# EAGLE design candle (EAGLE 6.6.0)
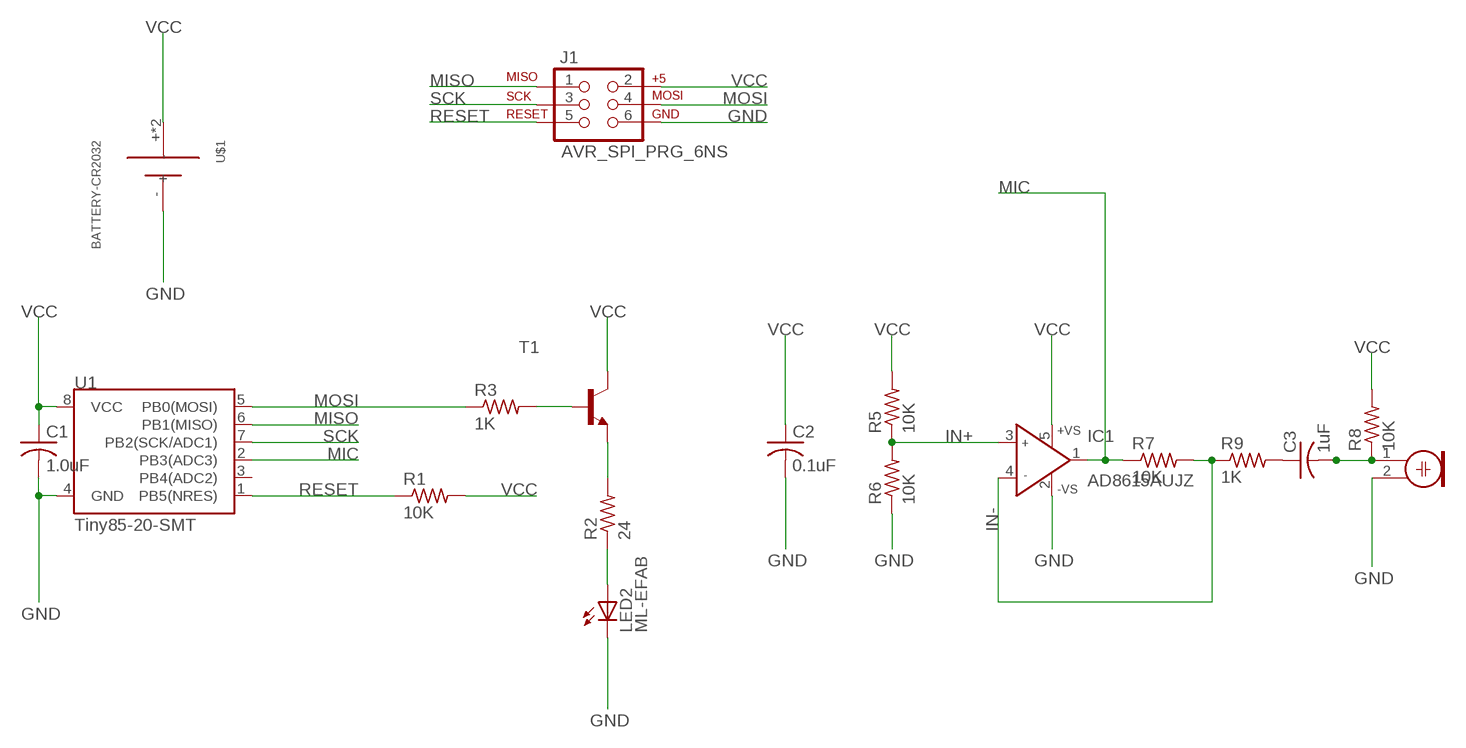
[diagram p0: schematic, sheet 1]

## Parts
C1  1.0uF  C-USC1206  [C1206]
C2  0.1uF  C-USC1206  [C1206]
C3  1uF  C-USC1206  [C1206]
IC1  AD8615AUJZ  AD8614RJ  [SOT23-5]
J1  AVR_SPI_PRG_6NS  [2X3-NS]
LED2  ML-EFAB  [ML-E-FAB]
M1  ELECTRETTH  [ELECTRET_6MM_TH]
R1  10K  R-US_R1206  [R1206]
R2  24  R-US_R1206  [R1206]
R3  1K  R-US_R1206  [R1206]
R5  10K  R-US_R1206  [R1206]
R6  10K  R-US_R1206  [R1206]
R7  10K  R-US_R1206  [R1206]
R8  10K  R-US_R1206  [R1206]
R9  1K  R-US_R1206  [R1206]
T1  MMBT3904LT1-NPN-SOT23-BEC  [SOT23-BEC]
U1  Tiny85-20-SMT  ATTINY45TINY85-20-SMT  [SO08-EIAJ]
U$1  BATTERY-CR2032  [CR2032_TH]

## Nets
GND: C1.2 C2.2 IC1.2(-VS) J1.6 LED2.C@1(C) M1.2 R6.1 U1.4(GND) U$1.-
IN+: IC1.3(IN+) R5.1 R6.2
IN-: IC1.4(IN-) R7.2 R9.1
MIC: IC1.1(OUT) R7.1 U1.2(PB3(ADC3))
MISO: J1.1 U1.6(PB1(MISO))
MOSI: J1.4 R3.1 U1.5(PB0(MOSI))
N$1: R2.2 T1.E
N$2: R3.2 T1.B
N$3: LED2.A@1(A) R2.1
N$4: C3.2 M1.1 R8.1
N$6: C3.1 R9.2
RESET: J1.5 R1.1 U1.1(PB5(NRES))
SCK: J1.3 U1.7(PB2(SCK/ADC1))
VCC: C1.1 C2.1 IC1.5(+VS) J1.2 R1.2 R5.2 R8.2 T1.C U1.8(VCC) U$1.+ U$1.+'(+)
Unconnected: LED2.A@2(A) LED2.C@2(C) LED2.TH U1.3(PB4(ADC2))

## Library data of the parts
C1-C3 = rcl:C-US: CAPACITOR, American symbol
IC1 = analog-devices:AD8614: Single and Quad 18 V Operational Amplifiers Source: http://www.analog.com/static/imported-files/data_sheets/AD8614_8644.pdf; MF: ALTERA CORPORATION; MPN: AD8614ARTZ-REEL7; OC_FARNELL: 1464998; OC_NEWARK: 88H0303
J1 = SparkFun-Connectors:AVR_SPI_PRG_6: AVR ISP 6 Pin This is the reduced ISP connector for AVR programming. Common on Arduino. This footprint will take up less PCB space and can be used with a 10-pin to 6-pin adapter such as SKU: BOB-08508 **Special note about "TEST_POINT" package. The stop mask is on the top side, so if you want your programming test points to be on the bottom of your board, make sure to place this package on the bottom side of the board. This also ensure that the orientation to program from the bottom side will be correct.
LED2 = LED Light:ML-E: Cree® XLamp® ML-E LEDs 1/2 watt, 3.5 x 3.5 mm Source: Data sheet <http://www.cree.com/products/pdf/XLampML-E.pdf>
M1 = LED Light:ELECTRET
R1-R3 R5-R9 = rcl:R-US_: RESISTOR, American symbol
T1 = transistor:*-NPN-: NPN Transistror BF959 corrected 2008.03.06
U1 = SparkFun-DigitalIC:ATTINY45: Atmel 8-pin 2/4/8kB flash uC; PROD_ID: IC-09092
U$1 = LED Light:BATTERY

## Board
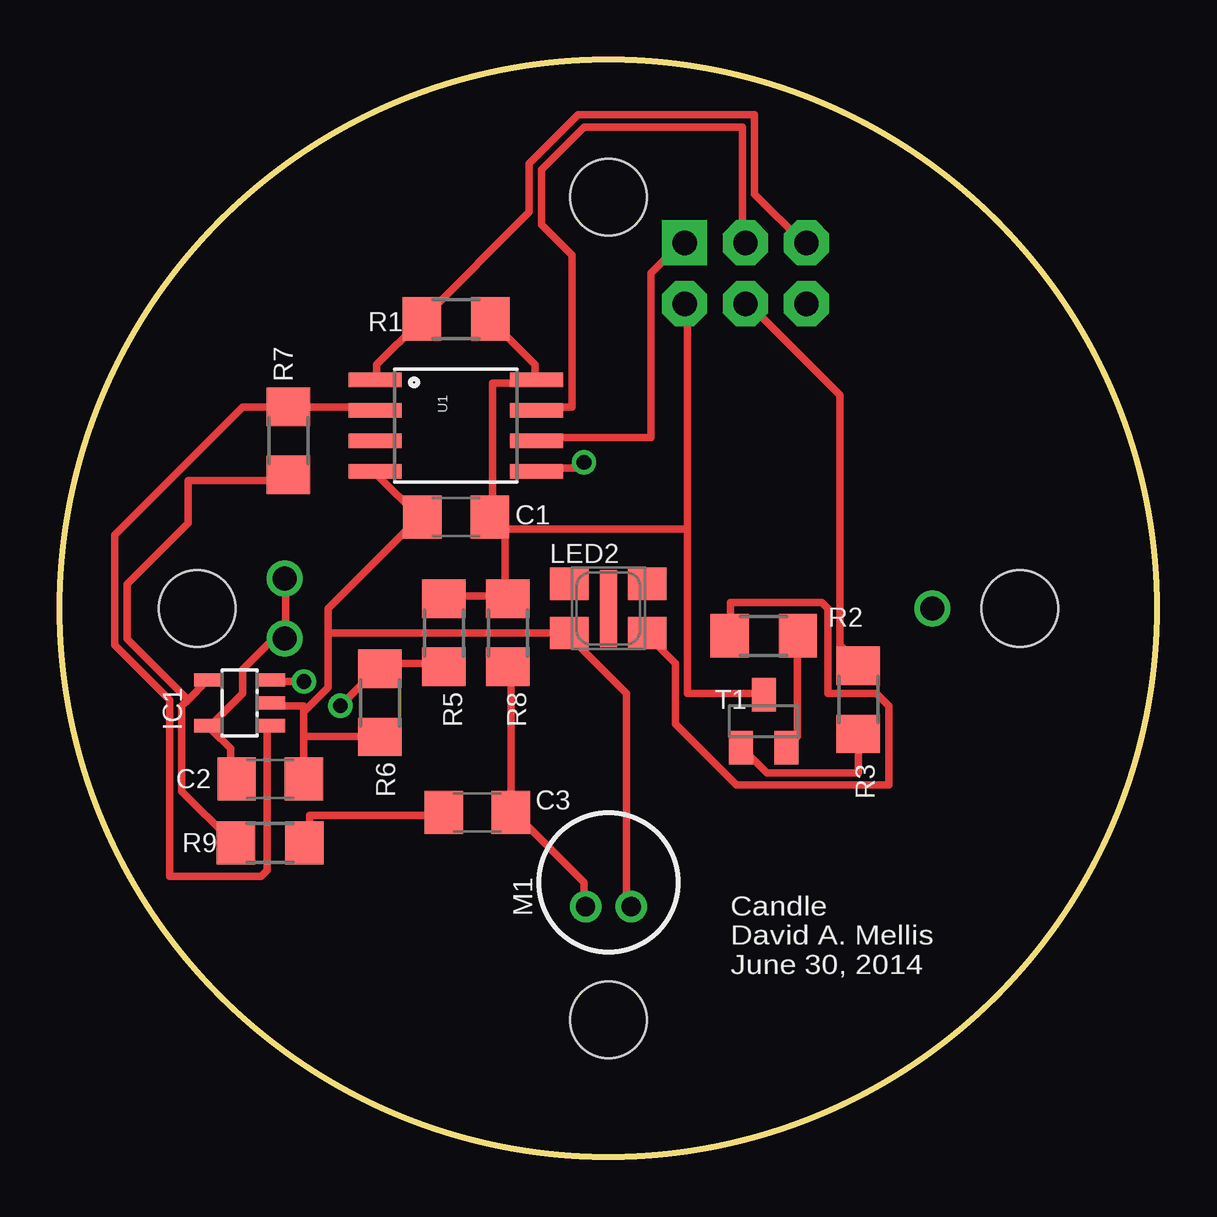
[diagram p1: board, top side]
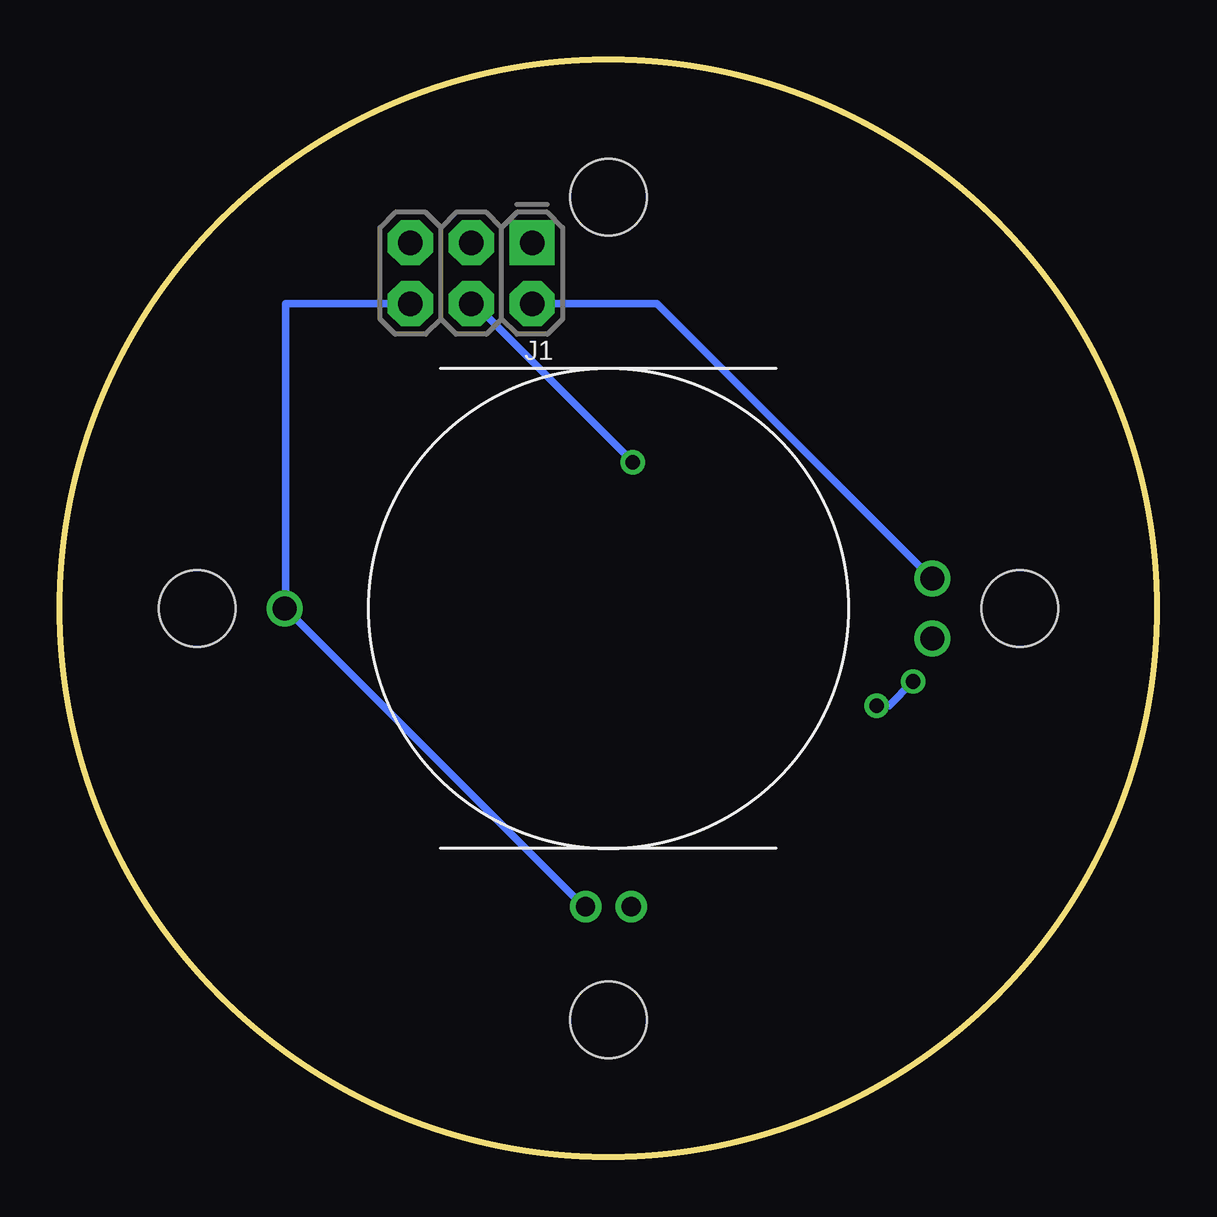
[diagram p2: board, bottom side, seen from below]

Size 45.72 x 45.72 mm. Coordinates in mm from the lower left corner, seen from the top.
Outline: circle at 22.86,22.86 radius 22.86
Copper layers (1*16): Top 0.035mm / dielectric 1.5mm / Bottom 0.035mm
Design rules "default *": minimum track width 12mil, minimum drill 24mil, track to track 8mil, track to pad 8mil, pad to pad 8mil, via to via 8mil, smd to smd 8mil, copper to edge 40mil, drill to drill 8mil, minimum pad ring 10mil, minimum via ring 8mil, stop-mask expansion 4mil, vias tented up to drill 0mil, thermal gap 10mil
Holes 3.2 mm at 40,22.86 5.71,22.86 22.86,40 22.86,5.71

### Footprints (pad centres in the part's own frame; a part is rotated, then mirrored left to right if it is on the bottom)
C1206 = smd 1.6 x 1.8: 1 -1.4,0; 2 1.4,0
SOT23-5 = smd 0.55 x 1.2: 1 -0.95,-1.3; 2 0,-1.3; 3 0.95,-1.3; 4 0.95,1.3; 5 -0.95,1.3
2X3-NS = drill 1.016 pad 1.88 square: 1 -2.54,-1.27 | drill 1.016 pad 1.88 octagon: 2 -2.54,1.27; 3 0,-1.27; 4 0,1.27; 5 2.54,-1.27; 6 2.54,1.27
ML-E-FAB = smd 1.6 x 1.35: A@1 1.625,-1.025; A@2 1.625,1.025; C@1 -1.625,-1.025; C@2 -1.625,1.025 | smd 0.7 x 3.2: TH 0,0
ELECTRET_6MM_TH = drill 0.8: 1 -1,0.95; 2 -1,-0.95
R1206 = smd 1.6 x 1.803: 1 -1.422,0; 2 1.422,0
SOT23-BEC = smd 1 x 1.4: B -0.95,-1.1; C 0,1.1; E 0.95,-1.1
SO08-EIAJ = smd 0.61 x 2.21: 1 -1.905,-3.378; 2 -0.635,-3.378; 3 0.635,-3.378; 4 1.905,-3.378; 5 1.905,3.353; 6 0.635,3.353; 7 -0.635,3.353; 8 -1.905,3.353
CR2032_TH = drill 1: + -13.5,1.25; +' -13.5,-1.25; - 13.5,0

### Placement (x,y rotation side)
C1  16.51,26.67 180 top
C2  8.76,15.75 0 top
C3  17.4,14.35 0 top
IC1  7.49,18.92 90 top
J1  28.57,36.83 180 bottom
LED2  22.86,22.86 0 top
M1  22.86,11.43 90 top
R1  16.51,34.92 0 top
R2  29.34,21.72 0 top
R3  33.27,19.05 270 top
R5  16,21.84 90 top
R6  13.33,18.92 90 top
R7  9.52,29.84 270 top
R8  18.67,21.84 90 top
R9  8.76,13.08 0 top
T1  29.34,18.16 0 top
U1  16.51,30.48 270 top
U$1  22.86,22.86 180 bottom

### Tracks (layer width: path | path; a pad name or v marks a point on that pad's centre or on a via)
GND
  Top 0.305: M1.2 23.62,10.67 23.62,19.3 21.34,21.59 LED2.C@1 21.08,21.84 11.18,21.84 | 14.99,26.67 13.21,28.45 U1.4 | 10.16,17.53 C2.2 | 10.16,17.53 10.16,18.54 | 10.16,18.54 10.16,18.8 8.89,18.8 IC1.2 | 10.16,17.53 13.21,17.53 R6.1 | 14.99,26.67 11.18,22.86 11.18,21.84 | 11.18,21.84 11.18,19.56 10.16,18.54 | 14.99,26.67 C1.2
  Bottom 0.305: 36.32,22.86 36.32,35.56 J1.6 | 36.32,22.86 24.13,10.67 23.88,10.67 M1.2 | 36.32,22.86 U$1.-
IN+  (via drill 0.61)
  Top 0.305: v10.16,19.81 8.89,19.81 IC1.3 | v11.68,18.8 13.21,20.32 R6.2 13.46,20.57 16,20.57 R5.1
  Bottom 0.305: v10.16,19.81 11.18,18.8 v11.68,18.8
IN-
  Top 0.305: 5.33,19.05 5.08,18.8 5.08,15.24 7.11,13.21 R9.1 | 5.33,19.05 6.1,19.81 IC1.4 | 5.33,19.05 2.79,21.59 2.79,23.88 5.33,26.42 5.33,28.19 9.4,28.19 R7.2
MIC
  Top 0.305: IC1.1 8.64,17.78 8.64,11.94 8.38,11.68 4.57,11.68 4.57,19.05 2.29,21.34 2.29,25.91 7.62,31.24 9.4,31.24 R7.1 9.65,31.24 12.95,31.24 U1.2
MISO
  Top 0.305: U1.6 20.07,29.97 24.64,29.97 24.64,36.83 25.91,38.1 J1.1
MOSI  (via drill 0.61)
  Top 0.305: R3.1 33.27,20.57 32.51,21.34 32.51,31.75 28.7,35.56 J1.4 | v21.84,28.96 21.84,28.7 20.07,28.7 U1.5
  Bottom 0.305: v21.84,28.96 28.45,35.56 J1.4
N$1
  Top 0.305: T1.E 30.48,17.27 30.73,17.53 30.73,21.59 R2.2
N$2
  Top 0.305: R3.2 33.27,16 29.46,16 28.45,17.02 T1.B
N$3
  Top 0.305: LED2.A@1 24.64,21.59 25.65,20.57 25.65,18.03 28.19,15.49 34.54,15.49 34.54,18.8 34.04,19.3 32,19.3 32,22.86 31.75,23.11 27.94,23.11 27.94,21.84 R2.1
N$4
  Top 0.305: M1.1 21.84,10.67 21.84,11.43 19.05,14.22 C3.2 18.8,14.48 18.8,20.32 R8.1
N$6
  Top 0.305: C3.1 15.75,14.22 10.41,14.22 10.41,13.21 R9.2
RESET
  Top 0.305: U1.1 13.21,32.51 13.21,33.02 14.99,34.8 R1.1 15.24,35.05 19.56,39.37 19.56,41.4 21.59,43.43 28.96,43.43 28.96,40.13 30.99,38.1 J1.5
SCK
  Top 0.305: U1.7 20.07,31.24 21.34,31.24 21.34,37.59 20.07,38.86 20.07,41.15 21.84,42.93 28.45,42.93 28.45,38.1 J1.3
VCC
  Top 0.305: R1.2 18.03,34.8 19.81,33.02 19.81,32.51 U1.8 19.81,32.26 18.03,32.26 18.03,26.67 | 18.54,26.16 18.03,26.67 | 18.54,23.37 18.54,26.16 | 18.54,23.37 16,23.37 R5.2 | 18.54,23.37 R8.2 | 18.03,26.67 C1.1 18.54,26.16 | C2.1 7.11,15.75 7.11,17.02 6.35,17.78 IC1.5 6.35,18.03 7.62,19.3 7.62,20.32 9.14,21.84 U$1.+ 9.4,21.84 9.4,23.88 U$1.+' | 26.16,26.16 26.16,35.56 J1.2 | 26.16,26.16 26.16,19.3 29.21,19.3 T1.C | 26.16,26.16 18.54,26.16
  Bottom 0.305: J1.2 20.83,35.56 9.4,24.13 U$1.+'

### Text on the board
tNames: Candle / David A. Mellis / June 30, 2014